# Altium project PCB_Project.PrjPcb
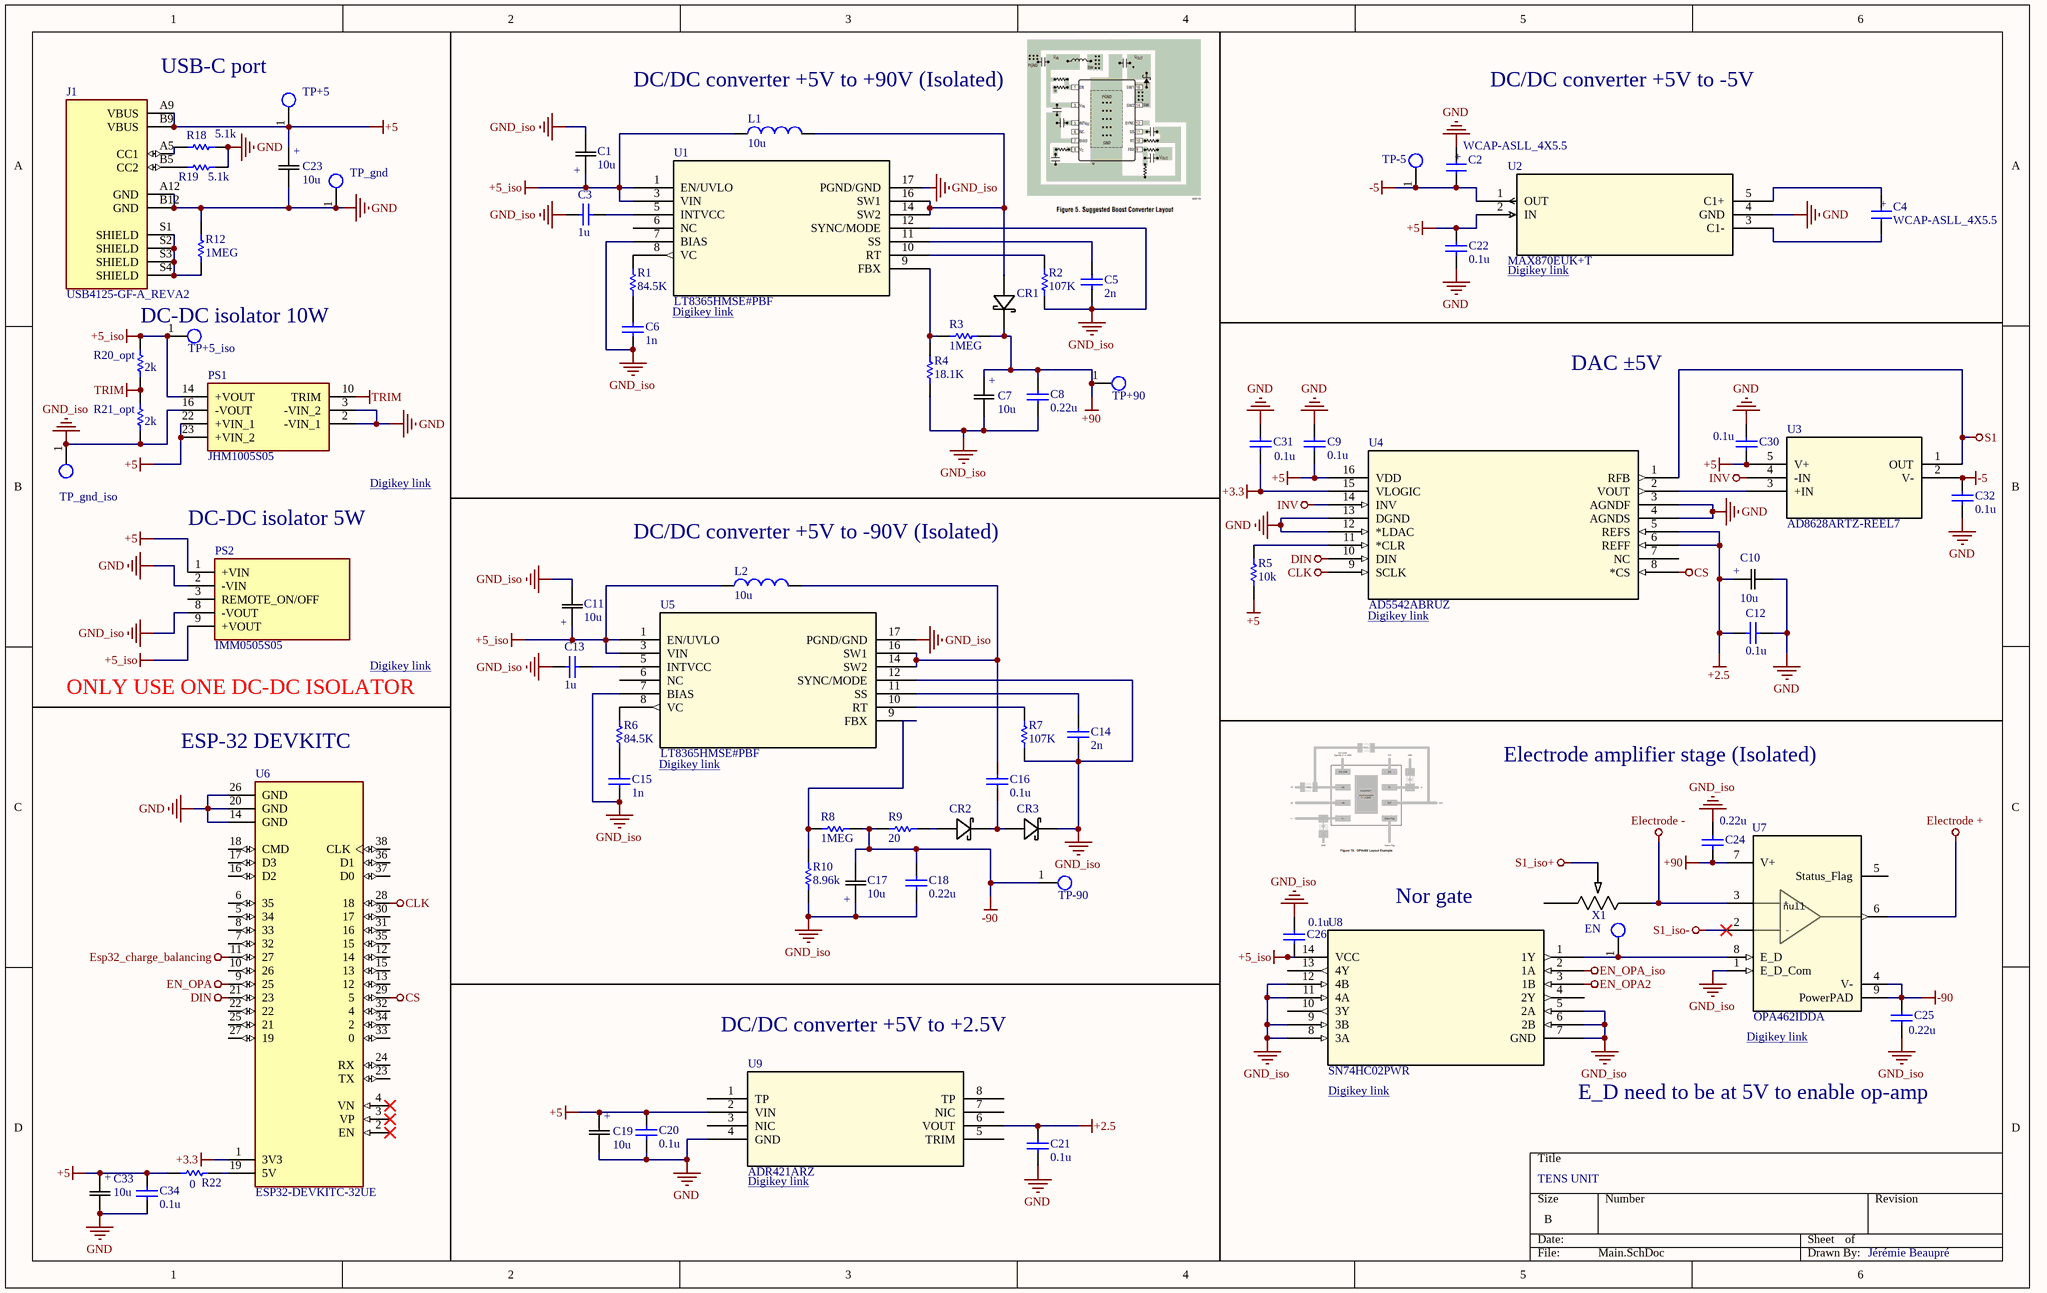
[diagram p0: Main.SchDoc]
4 sheets, 115 parts. Net scope: global (net labels, ports and power ports of the same name join across sheets).
Board file: PCB1.PcbDoc
Sheets:
  Main.SchDoc
  Current_check.SchDoc
  Isolation.SchDoc
  Read_me.SchDoc

## Sheet Main.SchDoc
size B; SheetNumber: 1; SheetTotal: 4

### Parts
C1  10u  [CAP_BX_10x20_RUB]
C2  WCAP-ASLL_4X5.5  [WCAP-ASLL_4X5.5(DXL)]
C3  value 1u  [0805_AVX]  (hidden comment: Capacitor)
C4  WCAP-ASLL_4X5.5  [WCAP-ASLL_4X5.5(DXL)]
C5  value 2n  [CAPC2012X75N]  (hidden comment: Capacitor)
C6  value 1n  [CC0805N_YAG]  (hidden comment: Capacitor)
C7  10u  [CAP_BX_10x20_RUB]
C8  value 0.22u  [CAP_C3225X7R2E224K200AA]  (hidden comment: Capacitor)
C9  value 0.1u  [CAPC2012X150N]  (hidden comment: Capacitor)
C10  10u  [CAP_BX_10x20_RUB]
C11  10u  [CAP_BX_10x20_RUB]
C12  value 0.1u  [CAPC2012X150N]  (hidden comment: Capacitor)
C13  value 1u  [0805_AVX]  (hidden comment: Capacitor)
C14  value 2n  [CAPC2012X75N]  (hidden comment: Capacitor)
C15  value 1n  [CC0805N_YAG]  (hidden comment: Capacitor)
C16  value 0.1u  [CAPC2012X150N]  (hidden comment: Capacitor)
C17  10u  [CAP_BX_10x20_RUB]
C18  value 0.22u  [CAP_C3225X7R2E224K200AA]  (hidden comment: Capacitor)
C19  10u  [CAP_BX_10x20_RUB]
C20  value 0.1u  [CAPC2012X150N]  (hidden comment: Capacitor)
C21  value 0.1u  [CAPC2012X150N]  (hidden comment: Capacitor)
C22  value 0.1u  [CAPC2012X150N]  (hidden comment: Capacitor)
C23  10u  [CAP_BX_10x20_RUB]
C24  value 0.22u  [CAP_C3225X7R2E224K200AA]  (hidden comment: Capacitor)
C25  value 0.22u  [CAP_C3225X7R2E224K200AA]  (hidden comment: Capacitor)
C26  value 0.1u  [CAPC2012X150N]  (hidden comment: Capacitor)
C30  value 0.1u  [CAPC2012X150N]  (hidden comment: Capacitor)
C31  value 0.1u  [CAPC2012X150N]  (hidden comment: Capacitor)
C32  value 0.1u  [CAPC2012X150N]  (hidden comment: Capacitor)
C33  10u  [CAP_BX_10x20_RUB]
C34  value 0.1u  [CAPC2012X150N]  (hidden comment: Capacitor)
CR1  SK220ATR  [DIODE_SK220ATR_SMC-M]  (value not drawn)
CR2  SK220ATR  [DIODE_SK220ATR_SMC-M]  (value not drawn)
CR3  SK220ATR  [DIODE_SK220ATR_SMC-M]  (value not drawn)
EN  Testpoint_1  [Testpoint1]  (value not drawn)  (no BOM)
J1  USB4125-GF-A_REVA2  [GCT_USB4125-GF-A_REVA2]
L1  value 10u  [DR73]  (hidden comment: Inductor)
L2  value 10u  [DR73]  (hidden comment: Inductor)
PS1  JHM1005S05  [JHM1005S05]
PS2  IMM0505S05  [IMM0505S05]
R1  value 84.5K  [Resistor_0805-M]  (hidden comment: Resistor)
R2  value 107K  [Resistor_0805-M]  (hidden comment: Resistor)
R3  value 1MEG  [Resistor_0805-M]  (hidden comment: Resistor)
R4  value 18.1K  [Resistor_0805-M]  (hidden comment: Resistor)
R5  value 10k  [Resistor_0805-M]  (hidden comment: Resistor)
R6  value 84.5K  [Resistor_0805-M]  (hidden comment: Resistor)
R7  value 107K  [Resistor_0805-M]  (hidden comment: Resistor)
R8  1MEG  [Resistor_0805-M]
R9  value 20  [Resistor_0805-M]  (hidden comment: Resistor)
R10  value 8.96k  [Resistor_0805-M]  (hidden comment: Resistor)
R12  value 1MEG  [Resistor_0805-M]  (hidden comment: Resistor)
R18  value 5.1k  [Resistor_0805-M]  (hidden comment: Resistor)
R19  value 5.1k  [Resistor_0805-M]  (hidden comment: Resistor)
R20_opt  value 2k  [Resistor_0805-M]  (hidden comment: Resistor)
R21_opt  value 2k  [Resistor_0805-M]  (hidden comment: Resistor)
R22  value 0  [Resistor_0805-M]  (hidden comment: Resistor)
TP+5  Testpoint_1  [Testpoint1]  (value not drawn)  (no BOM)
TP+5_iso  Testpoint_1  [Testpoint1]  (value not drawn)  (no BOM)
TP+90  Testpoint_1  [Testpoint1]  (value not drawn)  (no BOM)
TP-5  Testpoint_1  [Testpoint1]  (value not drawn)  (no BOM)
TP-90  Testpoint_1  [Testpoint1]  (value not drawn)  (no BOM)
TP_gnd  Testpoint_1  [Testpoint1]  (value not drawn)  (no BOM)
TP_gnd_iso  Testpoint_1  [Testpoint1]  (value not drawn)  (no BOM)
U1  LT8365HMSE#PBF  [05-08-1871_ADI]
U2  MAX870EUK+T  [21-0057F_MXM]
U3  AD8628ARTZ-REEL7  [RJ_5_ADI]
U4  AD5542ABRUZ  [RU_16_ADI]
U5  LT8365HMSE#PBF  [05-08-1871_ADI]
U6  ESP32-DEVKITC-32UE  [ESPRESSIF_ESP32-DEVKITC-32UE]
U7  OPA462IDDA  [DDA0008J-IPC_A]
U8  SN74HC02PWR  [PW14]
U9  ADR421ARZ  [R_8_ADI]
X1  PV36W102C01B00  [POT_PV36W_MUR]  (value not drawn)

### Nets
+2.5: C10.1(+) C12.2 C21.2 U4.5(REFS) U4.6(REFF) U9.6(VOUT)
+3.3: C31.2 U4.15(VLOGIC) U6.1(3V3)
+5: C9.2 C19.1(+) C20.2 C22.1 C23.1(+) C30.2 C33.1(+) C34.2 J1.A9(VBUS) J1.B9(VBUS) PS1.22(+VIN_1) PS1.23(+VIN_2) PS2.1(+VIN) R5.1 R22.2 TP+5.1(P1) U2.2(IN) U3.5(V+) U4.16(VDD) U9.2(VIN)
+5_iso: C1.1(+) C11.1(+) C26.1 L1.1 L2.1 PS1.14(+VOUT) PS2.9(+VOUT) R20_opt.1 TP+5_iso.1(P1) U1.1(EN/UVLO) U1.3(VIN) U5.1(EN/UVLO) U5.3(VIN) U8.14(VCC)
+90: C7.1(+) C8.2 C24.2 CR1.1 R3.2 TP+90.1(P1) U7.7(V+)
-5: C2.2(NEG) C32.2 TP-5.1(P1) U2.1(OUT) U3.2(V-)
-90: C17.2 C18.2 C25.1 R8.1 R9.2 TP-90.1(P1) U7.4(V-) U7.9(PowerPAD)
CLK: U4.9(SCLK) U6.28(18)
CS: U4.8(*CS) U6.29(5)
DIN: U4.10(DIN) U6.21(23)
Electrode +: U7.6(OUT)
Electrode -: U7.3(+IN) X1.3
EN_OPA: U6.9(25)
EN_OPA2: U8.3(1B)
EN_OPA_iso: U8.2(1A)
Esp32_charge_balancing: U6.11(27)
GND: C2.1(POS) C9.1 C10.2 C12.1 C19.2 C20.1 C21.1 C22.2 C23.2 C30.1 C31.1 C32.1 C33.2 C34.1 J1.A12(GND) J1.B12(GND) PS1.2(-VIN_1) PS1.3(-VIN_2) PS2.2(-VIN) R12.2 R18.1 R19.1 TP_gnd.1(P1) U2.4(GND) U4.3(AGNDF) U4.4(AGNDS) U4.12(*LDAC) U4.13(DGND) U6.14(GND) U6.20(GND) U6.26(GND) U9.4(GND)
GND_iso: C1.2 C3.2 C5.1 C6.1 C7.2 C8.1 C11.2 C13.2 C14.1 C15.1 C17.1(+) C18.1 C24.1 C25.2 C26.2 CR3.1 PS1.16(-VOUT) PS2.8(-VOUT) R2.1 R4.2 R7.1 R10.2 R21_opt.2 TP_gnd_iso.1(P1) U1.7(BIAS) U1.12(SYNC/MODE) U1.17(PGND/GND) U5.7(BIAS) U5.12(SYNC/MODE) U5.17(PGND/GND) U7.1(E_D_Com) U8.5(2A) U8.6(2B) U8.7(GND) U8.8(3A) U8.9(3B) U8.11(4A) U8.12(4B)
INV: U3.4(-IN) U4.14(INV)
S1: U3.1(OUT) U4.1(RFB)
S1_iso+: X1.2
S1_iso-: U7.2(-IN)
TRIM: PS1.10(TRIM) R20_opt.2 R21_opt.1
NetC3_1: C3.1 U1.5(INTVCC)
NetC4_1: C4.1(POS) U2.5(C1+)
NetC4_2: C4.2(NEG) U2.3(C1-)
NetC5_2: C5.2 U1.11(SS)
NetC6_2: C6.2 R1.1
NetC13_1: C13.1 U5.5(INTVCC)
NetC14_2: C14.2 U5.11(SS)
NetC15_2: C15.2 R6.1
NetC16_1: C16.1 CR2.1 CR3.2
NetC16_2: C16.2 L2.2 U5.14(SW2) U5.16(SW1)
NetCR1_2: CR1.2 L1.2 U1.14(SW2) U1.16(SW1)
NetCR2_2: CR2.2 R9.1
NetEN_1: EN.1(P1) U7.8(E_D) U8.1(1Y)
NetJ1_A5: J1.A5(CC1) R18.2
NetJ1_B5: J1.B5(CC2) R19.2
NetJ1_S1: J1.S1(SHIELD) J1.S2(SHIELD) J1.S3(SHIELD) J1.S4(SHIELD) R12.1
NetR1_2: R1.2 U1.8(VC)
NetR2_2: R2.2 U1.10(RT)
NetR3_1: R3.1 R4.1 U1.9(FBX)
NetR5_2: R5.2 U4.11(*CLR)
NetR6_2: R6.2 U5.8(VC)
NetR7_2: R7.2 U5.10(RT)
NetR8_2: R8.2 R10.1 U5.9(FBX)
NetR22_1: R22.1 U6.19(5V)
NetU3_3: U3.3(+IN) U4.2(VOUT)

Not connected (* = marked no-connect by the designer): PS2 3(REMOTE_ON/OFF); U1 6(NC); U4 7(NC); U5 6(NC); U6 2(EN)* 3(VP)* 4(VN)* 5(34) 6(35) 7(32) 8(33) 10(26) 12(14) 13(12) 15(13) 16(D2) 17(D3) 18(CMD) 22 23(TX) 24(RX) 25(21) 27(19) 30(17) 31(16) 32(4) 33(0) 34(2) 35(15) 36(D1) 37(D0) 38(CLK); U7 5(Status_Flag); U8 4(2Y) 10(3Y) 13(4Y); U9 1(TP) 3(NIC) 5(TRIM) 7(NIC) 8(TP); X1 1

### Notes on the sheet
- USB-C port
- (near L1) DC/DC converter +5V to +90V (Isolated)
- DC/DC converter +5V to -5V
- Digikey link <https://www.digikey.ca/en/products/detail/analog-devices-inc-maxim-integrated/MAX870EUK-T/1519059?_gl=1*bc40r*_up*MQ..*_gs*MQ..&gclid=Cj0KCQjwm8bTBhDWARIsAC9Hi8lZmiOB0El9-E_6c1ow4nDcjeTHfbqA0Lnjgy8U8yTUWBJwg5PWeQ0aAiB7EALw_wcB&gclsrc=aw.ds&gbraid=0AAAAADrbLlh2Yqokbm2Ifr7gOHjBvqx8v>
- (near TP+5_iso) DC-DC isolator 10W
- Digikey link <https://www.digikey.ca/en/products/detail/analog-devices-inc/LT8365HMSE-PBF/11586882?_gl=1*1sgahmh*_up*MQ..*_gs*MQ..&gclid=Cj0KCQjwm8bTBhDWARIsAC9Hi8lZmiOB0El9-E_6c1ow4nDcjeTHfbqA0Lnjgy8U8yTUWBJwg5PWeQ0aAiB7EALw_wcB&gclsrc=aw.ds&gbraid=0AAAAADrbLlh2Yqokbm2Ifr7gOHjBvqx8v>
- DAC ±5V
- Digikey link <https://www.digikey.ca/en/products/detail/xp-power/JHM1005S05/4488429?s=N4IgTCBcDaIFYAsC2BGADGgrAZyyAugL5A>
- (near PS2) DC-DC isolator 5W
- (near L2) DC/DC converter +5V to -90V (Isolated)
- (near U4) Digikey link <https://www.digikey.ca/en/products/detail/analog-devices-inc/AD5542ABRUZ/2506909?_gl=1*iimu8l*_up*MQ..*_gs*MQ..&gclid=Cj0KCQjwm8bTBhDWARIsAC9Hi8lZmiOB0El9-E_6c1ow4nDcjeTHfbqA0Lnjgy8U8yTUWBJwg5PWeQ0aAiB7EALw_wcB&gclsrc=aw.ds&gbraid=0AAAAADrbLlh2Yqokbm2Ifr7gOHjBvqx8v>
- (near PS2) ONLY USE ONE DC-DC ISOLATOR
- Digikey link <https://www.digikey.ca/en/products/detail/xp-power/IMM0505S05/9843481>
- (near U6) ESP-32 DEVKITC
- Electrode amplifier stage (Isolated)
- Nor gate
- DC/DC converter +5V to +2.5V
- (near U7) Digikey link <https://www.digikey.ca/en/products/detail/texas-instruments/OPA462IDDA/11502197?_gl=1*15g1sy5*_up*MQ..*_gs*MQ..&gclid=Cj0KCQjwm8bTBhDWARIsAC9Hi8lZmiOB0El9-E_6c1ow4nDcjeTHfbqA0Lnjgy8U8yTUWBJwg5PWeQ0aAiB7EALw_wcB&gclsrc=aw.ds&gbraid=0AAAAADrbLlh2Yqokbm2Ifr7gOHjBvqx8v>
- (near U8) Digikey link <https://www.digikey.ca/en/products/detail/texas-instruments/SN74HC02PWR/377046?_gl=1*15g1sy5*_up*MQ..*_gs*MQ..&gclid=Cj0KCQjwm8bTBhDWARIsAC9Hi8lZmiOB0El9-E_6c1ow4nDcjeTHfbqA0Lnjgy8U8yTUWBJwg5PWeQ0aAiB7EALw_wcB&gclsrc=aw.ds&gbraid=0AAAAADrbLlh2Yqokbm2Ifr7gOHjBvqx8v>
- E_D need to be at 5V to enable op-amp
- TENS UNIT
- (near U9) Digikey link <https://www.digikey.ca/en/products/detail/analog-devices-inc/ADR421ARZ/936588?_gl=1*1nl2uwz*_up*MQ..*_gs*MQ..&gclid=Cj0KCQjwm8bTBhDWARIsAC9Hi8lZmiOB0El9-E_6c1ow4nDcjeTHfbqA0Lnjgy8U8yTUWBJwg5PWeQ0aAiB7EALw_wcB&gclsrc=aw.ds&gbraid=0AAAAADrbLlh2Yqokbm2Ifr7gOHjBvqx8v>
- Jérémie Beaupré
- (in symbol OPA462IDDA) +; null; -
- (in symbol WCAP-ASLL_4X5.5) +

### Library data of the parts
C1 C7 C10 C11 C17 C19 C23 C33 = 450BXC10MEFC10X20: No Description Available; Manufacturer_Name: Rubycon; Copyright: Copyright (C) 2026 Ultra Librarian. All rights reserved.; Manufacturer_Part_Number: 450BXC10MEFC10X20
C2 C4 = WCAP-ASLL_4X5.5: MF: {'manufacturer': u'W\xfcrth Elektronik'}; MP: 865060640001; Package: None; Price: None; Value: *; Availability: Unavailable
C3 C5 C6 C8 C9 C12-C16 C18 C20-C22 C24-C26 C30-C32 C34 = Capacitor: SimulationGenericComponent: True
CR1-CR3 = SK220ATR: No Description Available; Manufacturer_Name: SMC Diode Solutions; Copyright: Copyright (C) 2026 Ultra Librarian. All rights reserved.; Manufacturer_Part_Number: SK220ATR
L1 L2 = Inductor: SimulationGenericComponent: True
PS1 = JHM1005S05: Power Supply; Manufacturer_Name: XP POWER; Datasheet Link: https://docs.rs-online.com/50a4/0900766b8150c28f.pdf; Height: 13.2mm; Manufacturer_Part_Number: JHM1005S05; Mouser Part Number: 209-JHM1005S05; Mouser Price/Stock: https://www.mouser.co.uk/ProductDetail/XP-Power/JHM1005S05?qs=w%2Fv1CP2dgqr7tGfLUXFVVQ%3D%3D
PS2 = IMM0505S05: Power Supply; Manufacturer_Name: XP POWER; Datasheet Link: https://www.xppower.com/portals/0/pdfs/SF_IMM05.pdf; Height: 13mm; Manufacturer_Part_Number: IMM0505S05; Mouser Part Number: 209-IMM0505S05; Mouser Price/Stock: https://www.mouser.co.uk/ProductDetail/XP-Power/IMM0505S05?qs=0lSvoLzn4L%2FxNlweCwWKNw%3D%3D
R1-R10 R12 R18 R19 R20_opt R21_opt = Resistor: TC1: 0; SimulationGenericComponent: True; TC2: 0
  R8: Value: 1MEG
R22 = Resistor: SimulationGenericComponent: True; TC1: 0; TC2: 0
U1 U5 = LT8365HMSEPBF: Low IQ Boost/SEPIC/Inverting Converter with 1.5A, 150V SwitchÂ; Manufacturer_Name: Analog Devices Inc; Type: Power Management; Copyright: Copyright (C) 2025 Ultra Librarian. All rights reserved.; Manufacturer_Part_Number: LT8365HMSE#PBF; RefDes: RefDes
U2 = MAX870EUK+T: Switched-Capacitor Voltage Inverters; Manufacturer_Name: Analog Devices Inc; Copyright: Copyright (C) 2026 Ultra Librarian. All rights reserved.; Manufacturer_Part_Number: MAX870EUK+T; RefDes: RefDes; Type: Type
U3 = AD8628ARTZ-REEL7: Zero-Drift, Single-Supply, Rail-to-Rail Input/Output Operational Amplifier; Manufacturer_Name: Analog Devices Inc; Copyright: Copyright (C) 2025 Ultra Librarian. All rights reserved.; Manufacturer_Part_Number: AD8628ARTZ-REEL7; RefDes: RefDes; Type: Type
U4 = AD5542ABRUZ: 2.7 V to 5.5 V, Serial-Input, Voltage-Output, 16-Bit nanoDACâ„¢ in 10-lead LFCSP, 16-lead 3 mm x 3 mm LFCSP, and 16-lead TSSOP; Manufacturer_Name: Analog Devices Inc; Copyright: Copyright (C) 2026 Ultra Librarian. All rights reserved.; Manufacturer_Part_Number: AD5542ABRUZ; RefDes: RefDes; Type: Type
U6 = ESP32-DEVKITC-32UE: The ESP32-DEVKITC-32UE evaluation board from Espressif Systems is designed for seamless wireless connectivity in IoT applications. Powered by the ESP32-WROOM-32UE module, it supports dual-mode BluetoothÂ® Smart Ready 4.x and 802.11 b/g/n Wi-Fi at 2.4GHz.; SnapEDA_Link: https://www.snapeda.com/parts/ESP32-DEVKITC-32UE/Espressif+Systems/view-part/?ref=snap; Package: CUSTOM-38 ESPRESSIF; Value: *; MF: Espressif Systems; MP: ESP32-DEVKITC-32UE; Check_prices: https://www.snapeda.com/parts/ESP32-DEVKITC-32UE/Espressif+Systems/view-part/?ref=eda
U7 = OPA462IDDA: 180-V, wide bandwidth (6.5 MHz), high-slew rate (25 V/Âµs) unity-gain stable op amp 8-SO PowerPAD -40 to 85; Manufacturer_Name: Texas Instruments; TYPE: TYPE; RefDes: RefDes; Copyright: Copyright (C) 2026 Ultra Librarian. All rights reserved.; Manufacturer_Part_Number: OPA462IDDA
U8 = SN74HC02PWR: 4-ch, 2-input, 2-V to 6-V 5.2 mA drive strength NOR gate 14-TSSOP -40 to 85; Manufacturer_Name: Texas Instruments; Copyright: Copyright (C) 2026 Ultra Librarian. All rights reserved.; Manufacturer_Part_Number: SN74HC02PWR; RefDes: RefDes; Type: Type
U9 = ADR421ARZ: Ultraprecision, Low Noise, 2.500 V XFETÂ® Voltage References; Manufacturer_Name: Analog Devices Inc; Copyright: Copyright (C) 2026 Ultra Librarian. All rights reserved.; Manufacturer_Part_Number: ADR421ARZ; RefDes: RefDes; Type: Type
X1 = PV36W102C01B00: No Description Available; Manufacturer_Name: Murata; Copyright: Copyright (C) 2026 Ultra Librarian. All rights reserved.; Manufacturer_Part_Number: PV36W102C01B00
J1 = USB4125-GF-A_REVA2: Package: None; Availability: Unavailable; MP: USB4125-GF-A_REVA2; Value: *; Price: None

## Sheet Current_check.SchDoc
size A; SheetNumber: 2; SheetTotal: 4
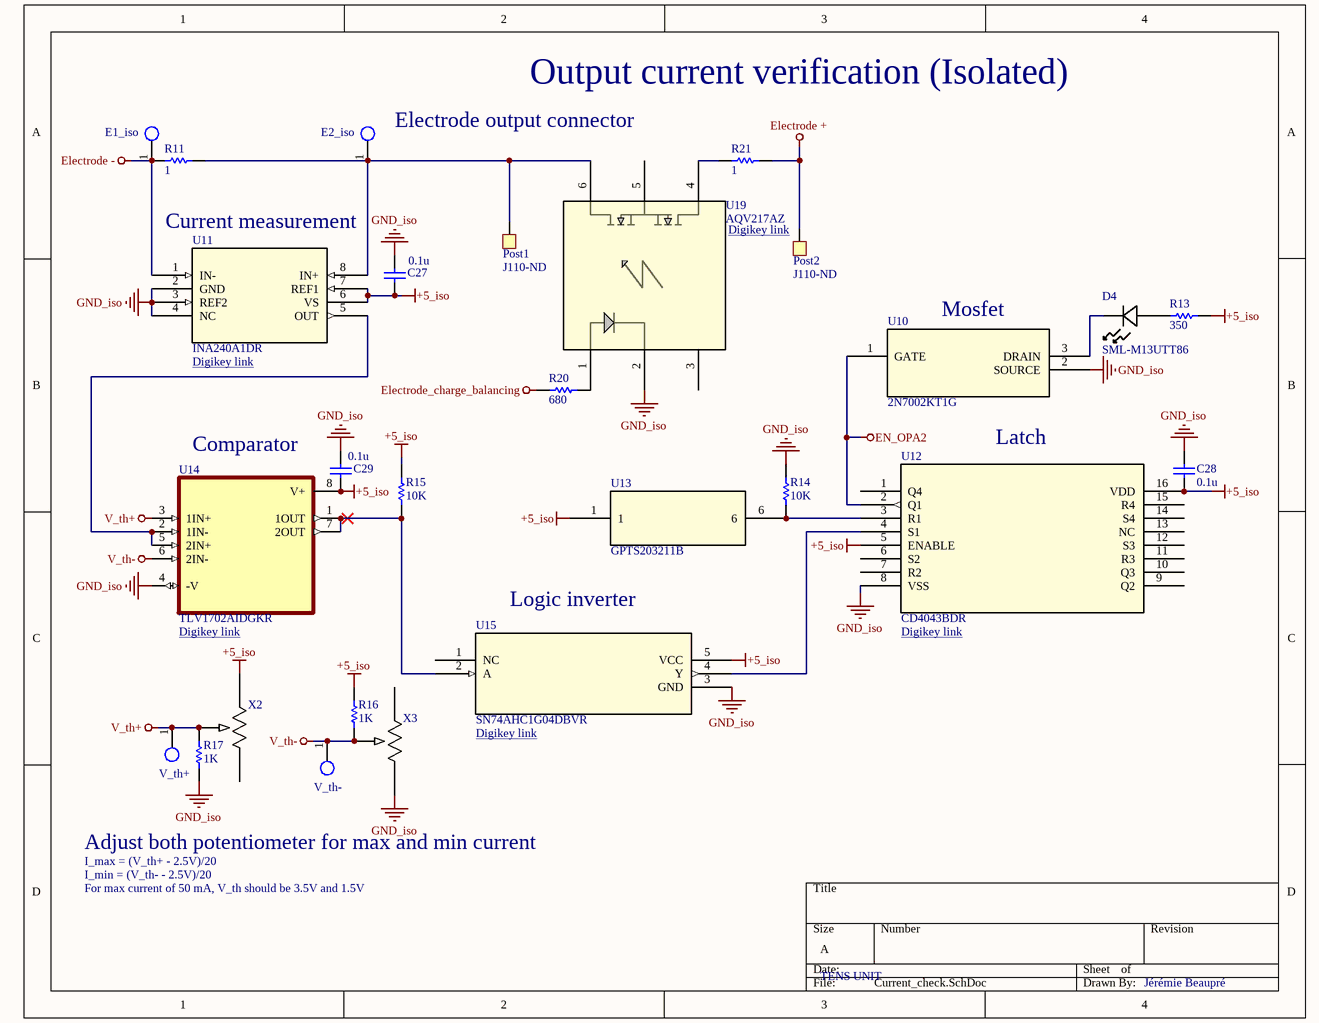
[diagram p1: Current_check.SchDoc]

### Parts
C27  value 0.1u  [CAPC2012X150N]  (hidden comment: Capacitor)
C28  value 0.1u  [CAPC2012X150N]  (hidden comment: Capacitor)
C29  value 0.1u  [CAPC2012X150N]  (hidden comment: Capacitor)
D4  SML-M13UTT86  [LED_SML-M13DT_ROM]
E1_iso  Testpoint_1  [Testpoint1]  (value not drawn)  (no BOM)
E2_iso  Testpoint_1  [Testpoint1]  (value not drawn)  (no BOM)
Post1  J110-ND  [J110-ND]
Post2  J110-ND  [J110-ND]
R11  value 1  [Resistor_0805-M]  (hidden comment: Resistor)
R13  value 350  [Resistor_0805-M]  (hidden comment: Resistor)
R14  value 10K  [Resistor_0805-M]  (hidden comment: Resistor)
R15  value 10K  [Resistor_0805-M]  (hidden comment: Resistor)
R16  value 1K  [Resistor_0805-M]  (hidden comment: Resistor)
R17  value 1K  [Resistor_0805-M]  (hidden comment: Resistor)
R20  value 680  [Resistor_0805-M]  (hidden comment: Resistor)
R21  value 1  [Resistor_0805-M]  (hidden comment: Resistor)
U10  2N7002KT1G  [SOT-23_ONS]
U11  INA240A1DR  [D8_TEX]
U12  CD4043BDR  [D16]
U13  GPTS203211B  [SWITCH_03211B]
U14  TLV1702AIDGKR  [SOP65P490X110-8N]
U15  SN74AHC1G04DBVR  [DBV5]
U19  AQV217AZ  [DIP-6_SMD_PAN]
V_th+  Testpoint_1  [Testpoint1]  (value not drawn)  (no BOM)
V_th-  Testpoint_1  [Testpoint1]  (value not drawn)  (no BOM)
X2  PV36W102C01B00  [POT_PV36W_MUR]  (value not drawn)
X3  PV36W102C01B00  [POT_PV36W_MUR]  (value not drawn)

### Nets
+5_iso: C27.2 C28.2 C29.2 R13.2 R15.2 R16.2 U11.6(VS) U11.7(REF1) U12.5(ENABLE) U12.16(VDD) U13.1 U14.8(V+) U15.5(VCC) X2.3
Electrode +: Post2.1 R21.1
Electrode -: E1_iso.1(P1) R11.1 U11.1(IN-)
Electrode_charge_balancing: R20.2
EN_OPA2: U10.1(GATE) U12.2(Q1)
GND_iso: C27.1 C28.1 C29.1 R14.2 R17.1 U10.2(SOURCE) U11.2(GND) U11.3(REF2) U11.4(NC) U12.8(VSS) U14.4(-V) U15.3(GND) U19.2 X3.1
V_th+: R17.2 U14.3(1IN+) V_th+.1(P1) X2.2
V_th-: R16.1 U14.6(2IN-) V_th-.1(P1) X3.2
NetD4_1: D4.1 U10.3(DRAIN)
NetD4_2: D4.2 R13.1
NetE2_iso_1: E2_iso.1(P1) Post1.1 R11.2 U11.8(IN+) U19.6
NetR14_1: R14.1 U12.3(R1) U13.6
NetR15_1: R15.1 U14.1(1OUT) U14.7(2OUT) U15.2(A)
NetR20_1: R20.1 U19.1
NetR21_2: R21.2 U19.4
NetU11_5: U11.5(OUT) U14.2(1IN-) U14.5(2IN+)
NetU12_4: U12.4(S1) U15.4(Y)

Not connected (* = marked no-connect by the designer): U12 1(Q4) 6(S2) 7(R2) 9(Q2) 10(Q3) 11(R3) 12(S3) 13(NC) 14(S4) 15(R4); U15 1(NC); U19 3(5) 5(4); X2 1; X3 3

### Notes on the sheet
- Output current verification (Isolated)
- (near E2_iso) Electrode output connector
- Current measurement
- (near Post2) Digikey link <https://www.digikey.ca/en/products/detail/panasonic-industry/AQV217AZ/646090?s=N4IgTCBcDaIIIEUBqYCMB2OAtEBdAvkA>
- (near U11) Digikey link <https://www.digikey.ca/en/products/detail/texas-instruments/INA240A1DR/8538109?_gl=1*1puq8vm*_up*MQ..*_gs*MQ..&gclid=Cj0KCQjwm8bTBhDWARIsAC9Hi8lZmiOB0El9-E_6c1ow4nDcjeTHfbqA0Lnjgy8U8yTUWBJwg5PWeQ0aAiB7EALw_wcB&gclsrc=aw.ds&gbraid=0AAAAADrbLlh2Yqokbm2Ifr7gOHjBvqx8v>
- (near U10) Mosfet
- Comparator
- Latch
- Digikey link <https://www.digikey.ca/en/products/detail/texas-instruments/TLV1702AIDGKR/4555458?_gl=1*2ig6y2*_up*MQ..*_gs*MQ..&gclid=Cj0KCQjwm8bTBhDWARIsAC9Hi8lZmiOB0El9-E_6c1ow4nDcjeTHfbqA0Lnjgy8U8yTUWBJwg5PWeQ0aAiB7EALw_wcB&gclsrc=aw.ds&gbraid=0AAAAADrbLlh2Yqokbm2Ifr7gOHjBvqx8v>
- Logic inverter
- (near U12) Digikey link <https://www.digikey.ca/en/products/detail/texas-instruments/CD4043BDR/1691049?_gl=1*2ig6y2*_up*MQ..*_gs*MQ..&gclid=Cj0KCQjwm8bTBhDWARIsAC9Hi8lZmiOB0El9-E_6c1ow4nDcjeTHfbqA0Lnjgy8U8yTUWBJwg5PWeQ0aAiB7EALw_wcB&gclsrc=aw.ds&gbraid=0AAAAADrbLlh2Yqokbm2Ifr7gOHjBvqx8v>
- (near U15) Digikey link <https://www.digikey.ca/en/products/detail/texas-instruments/SN74AHC1G04DBVR/276733?_gl=1*2ig6y2*_up*MQ..*_gs*MQ..&gclid=Cj0KCQjwm8bTBhDWARIsAC9Hi8lZmiOB0El9-E_6c1ow4nDcjeTHfbqA0Lnjgy8U8yTUWBJwg5PWeQ0aAiB7EALw_wcB&gclsrc=aw.ds&gbraid=0AAAAADrbLlh2Yqokbm2Ifr7gOHjBvqx8v>
- Adjust both potentiometer for max and min current
- I_max = (V_th+ - 2.5V)/20
- I_min = (V_th- - 2.5V)/20
- For max current of 50 mA, V_th should be 3.5V and 1.5V
- TENS UNIT
- Jérémie Beaupré

### Library data of the parts
C27-C29 = Capacitor: SimulationGenericComponent: True
D4 = SML-M13UTT86: No Description Available; Manufacturer_Name: ROHM Semiconductor; Copyright: Copyright (C) 2026 Ultra Librarian. All rights reserved.; Manufacturer_Part_Number: SML-M13UTT86
R11 R13-R17 R20 R21 = Resistor: TC1: 0; SimulationGenericComponent: True; TC2: 0
U10 = 2N7002KT1G: Description; Manufacturer_Name: onsemi; Copyright: Copyright (C) 2026 Ultra Librarian. All rights reserved.; Manufacturer_Part_Number: 2N7002KT1G; RefDes: RefDes; Type: Type
U11 = INA240A1DR: -4 to 80V, bidirectional, ultra-precise current sense amplifier with enhanced PWM rejection 8-SOIC -40 to 125; Manufacturer_Name: Texas Instruments; Copyright: Copyright (C) 2025 Ultra Librarian. All rights reserved.; Manufacturer_Part_Number: INA240A1DR; RefDes: RefDes; Type: Type
U12 = CD4043BDR: CMOS Quad NOR R/S Latch with 3-State Outputs 16-SOIC -55 to 125; Manufacturer_Name: Texas Instruments; Copyright: Copyright (C) 2025 Ultra Librarian. All rights reserved.; Manufacturer_Part_Number: CD4043BDR; RefDes: RefDes; Type: Type
U13 = GPTS203211B: No Description Available; Manufacturer_Name: CW Industries; Copyright: Copyright (C) 2026 Ultra Librarian. All rights reserved.; Manufacturer_Part_Number: GPTS203211B; RefDes: RefDes; Type: Type
U14 = TLV1702AIDGKR: Dual high voltage, low power comparator; MF: Texas Instruments; SnapEDA_Link: https://www.snapeda.com/parts/TLV1702AIDGKR/Texas+Instruments/view-part/?ref=snap; Package: VSSOP-8 Texas Instruments; Value: *; MP: TLV1702AIDGKR; Check_prices: https://www.snapeda.com/parts/TLV1702AIDGKR/Texas+Instruments/view-part/?ref=eda
U15 = SN74AHC1G04DBVR: Single 2-V to 5.5-V inverter 5-SOT-23 -40 to 125; Manufacturer_Name: Texas Instruments; Copyright: Copyright (C) 2026 Ultra Librarian. All rights reserved.; Manufacturer_Part_Number: SN74AHC1G04DBVR; RefDes: RefDes; Type: Type
U19 = AQV217AZ: No Description Available; Manufacturer_Name: Panasonic; Copyright: Copyright (C) 2026 Ultra Librarian. All rights reserved.; Manufacturer_Part_Number: AQV217AZ; RefDes: RefDes; Type: Type
X2 X3 = PV36W102C01B00: as X1 on sheet Main; Copyright: Copyright (C) 2026 Ultra Librarian. All rights reserved.; Manufacturer_Part_Number: PV36W102C01B00

## Sheet Isolation.SchDoc
size A; SheetNumber: 3; SheetTotal: 3
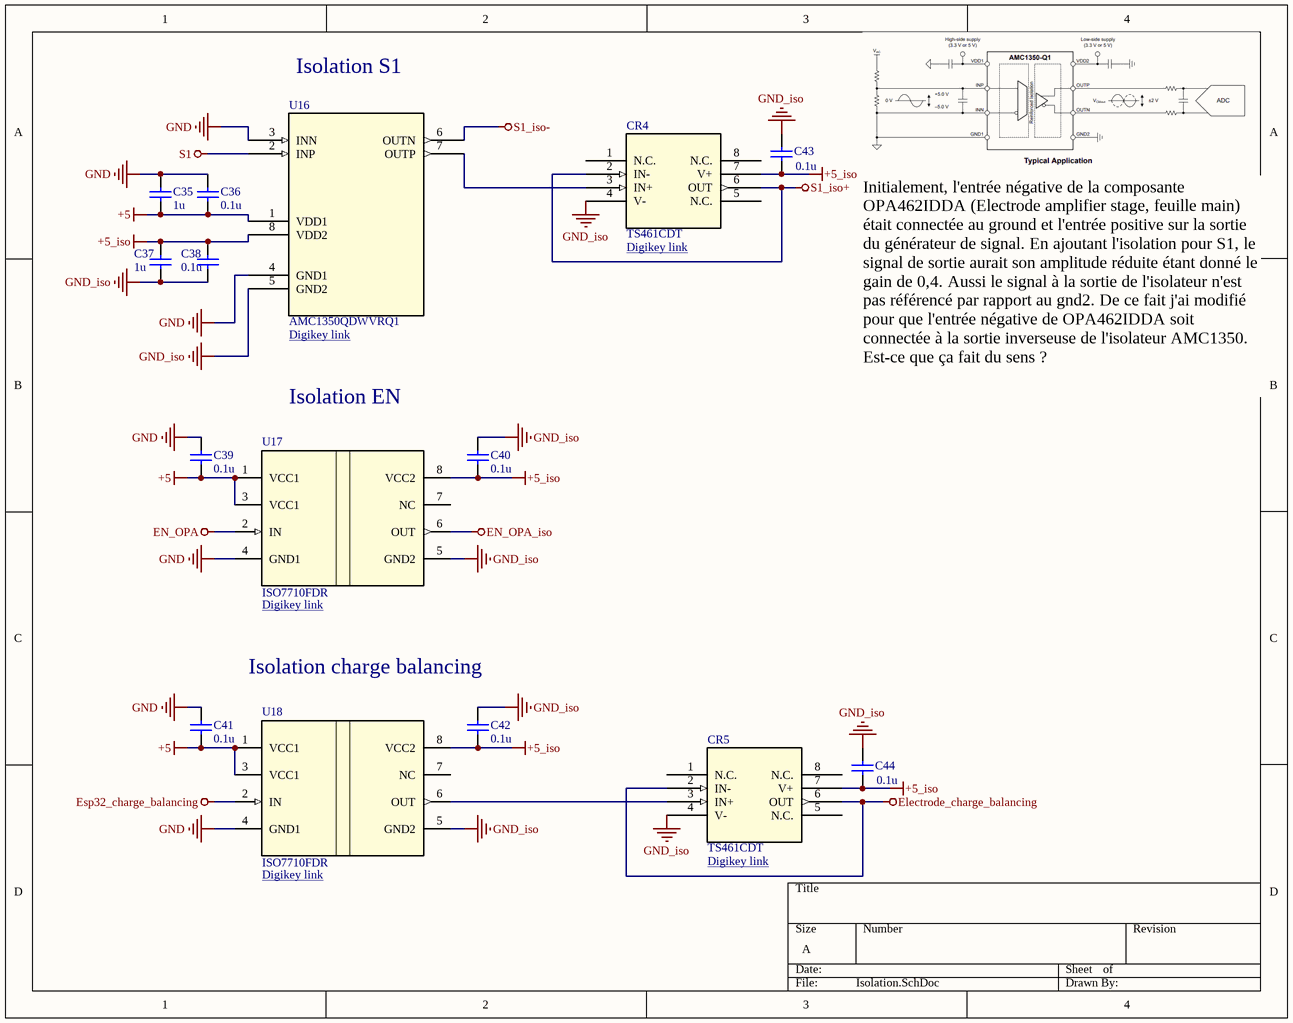
[diagram p2: Isolation.SchDoc]

### Parts
C35  value 1u  [0805_AVX]  (hidden comment: Capacitor)
C36  value 0.1u  [CAPC2012X150N]  (hidden comment: Capacitor)
C37  value 1u  [0805_AVX]  (hidden comment: Capacitor)
C38  value 0.1u  [CAPC2012X150N]  (hidden comment: Capacitor)
C39  value 0.1u  [CAPC2012X150N]  (hidden comment: Capacitor)
C40  value 0.1u  [CAPC2012X150N]  (hidden comment: Capacitor)
C41  value 0.1u  [CAPC2012X150N]  (hidden comment: Capacitor)
C42  value 0.1u  [CAPC2012X150N]  (hidden comment: Capacitor)
C43  value 0.1u  [CAPC2012X150N]  (hidden comment: Capacitor)
C44  value 0.1u  [CAPC2012X150N]  (hidden comment: Capacitor)
CR4  TS461CDT  [SO-8_STM]
CR5  TS461CDT  [SO-8_STM]
U16  AMC1350QDWVRQ1  [AMC1350QDWVRQ1_TEX]
U17  ISO7710FDR  [D0008B_N]
U18  ISO7710FDR  [D0008B_N]

### Nets
+5: C35.2 C36.1 C39.2 C41.2 U16.1(VDD1) U17.1(VCC1) U17.3(VCC1) U18.1(VCC1) U18.3(VCC1)
+5_iso: C37.1 C38.2 C40.2 C42.2 C43.2 C44.2 CR4.7(V+) CR5.7(V+) U16.8(VDD2) U17.8(VCC2) U18.8(VCC2)
Electrode_charge_balancing: CR5.2(IN-) CR5.6(OUT)
EN_OPA: U17.2(IN)
EN_OPA_iso: U17.6(OUT)
Esp32_charge_balancing: U18.2(IN)
GND: C35.1 C36.2 C39.1 C41.1 U16.3(INN) U16.4(GND1) U17.4(GND1) U18.4(GND1)
GND_iso: C37.2 C38.1 C40.1 C42.1 C43.1 C44.1 CR4.4(V-) CR5.4(V-) U16.5(GND2) U17.5(GND2) U18.5(GND2)
S1: U16.2(INP)
S1_iso+: CR4.2(IN-) CR4.6(OUT)
S1_iso-: U16.6(OUTN)
NetCR4_3: CR4.3(IN+) U16.7(OUTP)
NetCR5_3: CR5.3(IN+) U18.6(OUT)

Not connected (* = marked no-connect by the designer): CR4 1(N.C.) 5(N.C.) 8(N.C.); CR5 1(N.C.) 5(N.C.) 8(N.C.); U17 7(NC); U18 7(NC)

### Notes on the sheet
- Isolation S1
- (near CR4) Digikey link <https://www.digikey.ca/en/products/detail/stmicroelectronics/TS461CDT/599260?s=N4IgTCBcDaICoGUAsA2AjAYQCJxAXQF8g>
- (near U16) Digikey link <https://www.digikey.ca/en/products/detail/texas-instruments/AMC1350QDWVRQ1/16184258?gclsrc=aw.ds&gad_source=1&gad_campaignid=23536462204&gbraid=0AAAAADrbLlgPIMavqT0FMg8RnG3SAJlVn&gclid=CjwKCAjwtp7VBhBjEiwAJfpV-7trzx5dm_GJ_BDihVdM6MrJPevNCHBW8ri5qEOeuZCw5XcXnlMmKhoCRM0QAvD_BwE>
- Isolation EN
- Initialement, l'entrée négative de la composante OPA462IDDA (Electrode amplifier stage, feuille main) était connectée au ground et l'entrée positive sur la sortie du générateur de signal. En ajoutant l'isolation pour S1, le signal de sortie aurait son amplitude réduite étant donné le gain de 0,4. Aussi le signal à la sortie de l'isolateur n'est pas référencé par rapport au gnd2. De ce fait j'ai modifié pour que l'entrée négative de OPA462IDDA soit connectée à la sortie inverseuse de l'isolateur AMC1350. Est-ce que ça fait du sens ?
- (near U17) Digikey link <https://www.digikey.ca/en/products/detail/texas-instruments/ISO7710FDR/7173733>
- Isolation charge balancing
- (near U18) Digikey link <https://www.digikey.ca/en/products/detail/texas-instruments/ISO7710FDR/7173733>
- (near CR5) Digikey link <https://www.digikey.ca/en/products/detail/stmicroelectronics/TS461CDT/599260?s=N4IgTCBcDaICoGUAsA2AjAYQCJxAXQF8g>

### Library data of the parts
C35-C44 = Capacitor: SimulationGenericComponent: True
CR4 CR5 = TS461CDT: Output rail-to-rail op-amps; Manufacturer_Name: STMicroelectronics; Copyright: Copyright (C) 2026 Ultra Librarian. All rights reserved.; Manufacturer_Part_Number: TS461CDT; Datasheet: https://www.st.com/resource/en/datasheet/ts461.pdf; RefDes: RefDes; Type: Type
U16 = AMC1350QDWVRQ1: Automotive, &plusmn;5-V input, precision voltage sensing reinforced isolated amplifier 8-SOIC -40 to 125; Manufacturer_Name: Texas Instruments; Copyright: Copyright (C) 2026 Ultra Librarian. All rights reserved.; Manufacturer_Part_Number: AMC1350QDWVRQ1; RefDes: RefDes; Type: Type
U17 U18 = ISO7710FDR: Robust EMC, single-channel, reinforced digital isolator 8-SOIC -55 to 125; Manufacturer_Name: Texas Instruments; TYPE: TYPE; RefDes: RefDes; Copyright: Copyright (C) 2026 Ultra Librarian. All rights reserved.; Manufacturer_Part_Number: ISO7710FDR

## Sheet Read_me.SchDoc
size A; SheetNumber: 4; SheetTotal: 4
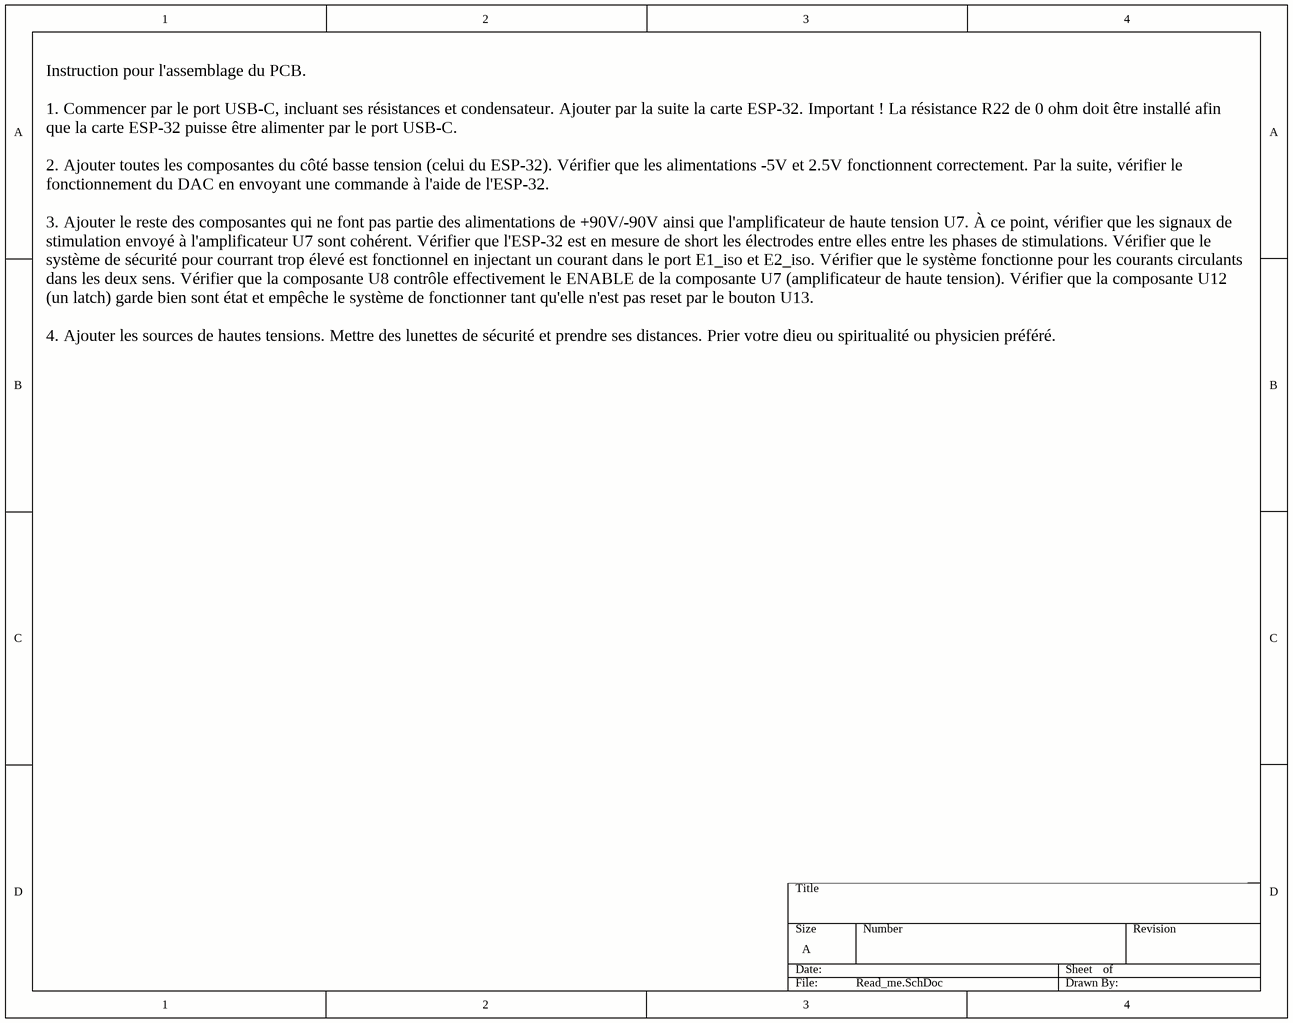
[diagram p3: Read_me.SchDoc]

### Notes on the sheet
- Instruction pour l'assemblage du PCB.
  1. Commencer par le port USB-C, incluant ses résistances et condensateur. Ajouter par la suite la carte ESP-32. Important ! La résistance R22 de 0 ohm doit être installé afin que la carte ESP-32 puisse être alimenter par le port USB-C.
  2. Ajouter toutes les composantes du côté basse tension (celui du ESP-32). Vérifier que les alimentations -5V et 2.5V fonctionnent correctement. Par la suite, vérifier le fonctionnement du DAC en envoyant une commande à l'aide de l'ESP-32.
  3. Ajouter le reste des composantes qui ne font pas partie des alimentations de +90V/-90V ainsi que l'amplificateur de haute tension U7. À ce point, vérifier que les signaux de stimulation envoyé à l'amplificateur U7 sont cohérent. Vérifier que l'ESP-32 est en mesure de short les électrodes entre elles entre les phases de stimulations. Vérifier que le système de sécurité pour courrant trop élevé est fonctionnel en injectant un courant dans le port E1_iso et E2_iso. Vérifier que le système fonctionne pour les courants circulants dans les deux sens. Vérifier que la composante U8 contrôle effectivement le ENABLE de la composante U7 (amplificateur de haute tension). Vérifier que la composante U12 (un latch) garde bien sont état et empêche le système de fonctionner tant qu'elle n'est pas reset par le bouton U13.
  4. Ajouter les sources de hautes tensions. Mettre des lunettes de sécurité et prendre ses distances. Prier votre dieu ou spiritualité ou physicien préféré.

## Nets that join several sheets
+5: Main (20 pins), Isolation (9 pins)
+5_iso: Main (14 pins), Current_check (14 pins), Isolation (11 pins)
Electrode +: Main (U7.6), Current_check (Post2.1 R21.1)
Electrode -: Main (U7.3 X1.3), Current_check (E1_iso.1 R11.1 U11.1)
Electrode_charge_balancing: Current_check (R20.2), Isolation (CR5.2 CR5.6)
EN_OPA: Main (U6.9), Isolation (U17.2)
EN_OPA2: Main (U8.3), Current_check (U10.1 U12.2)
EN_OPA_iso: Main (U8.2), Isolation (U17.6)
Esp32_charge_balancing: Main (U6.11), Isolation (U18.2)
GND: Main (32 pins), Isolation (8 pins)
GND_iso: Main (38 pins), Current_check (14 pins), Isolation (11 pins)
S1: Main (U3.1 U4.1), Isolation (U16.2)
S1_iso+: Main (X1.2), Isolation (CR4.2 CR4.6)
S1_iso-: Main (U7.2), Isolation (U16.6)